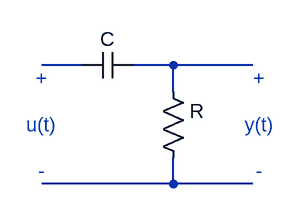
[diagram p0: schematic pre4.asc]
pre4.asc, the LTspice schematic file:
Version 4.1
SHEET 1 880 680
WIRE 80 112 32 112
WIRE 192 112 144 112
WIRE 288 112 192 112
WIRE 192 144 192 112
WIRE 192 256 192 224
WIRE 192 256 32 256
WIRE 288 256 192 256
SYMBOL cap 144 96 R90
WINDOW 0 0 32 VBottom 2
WINDOW 3 32 32 VTop 2
SYMATTR InstName C
SYMATTR Value ""
SYMBOL res 176 128 R0
SYMATTR InstName R
SYMATTR Value ""
TEXT 296 128 Center 2 ;+
TEXT 296 240 Center 2 ;-
TEXT 296 184 Center 2 ;y(t)
TEXT 32 128 Center 2 ;+
TEXT 32 240 Center 2 ;-
TEXT 32 184 Center 2 ;u(t)

The netlist it stands for:
* pre4.asc
C N002 N001
R N002 N003
* +
* -
* y(t)
* +
* -
* u(t)
.backanno
.end